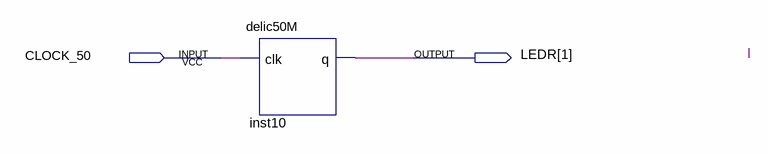
[diagram p0: schematic sheet]
// Quartus schematic hodiny_min.bdf as structural Verilog: 1 symbols, 2 pins
module hodiny_min (
  input  CLOCK_50,
  output [1:1] LEDR
);

  delic50M inst10 (.clk(CLOCK_50), .q(LEDR[1]));
endmodule
